# Altium schematic sheet Wall_Crawller_Application.SchDoc
size B; SheetNumber: 1; SheetTotal: 1
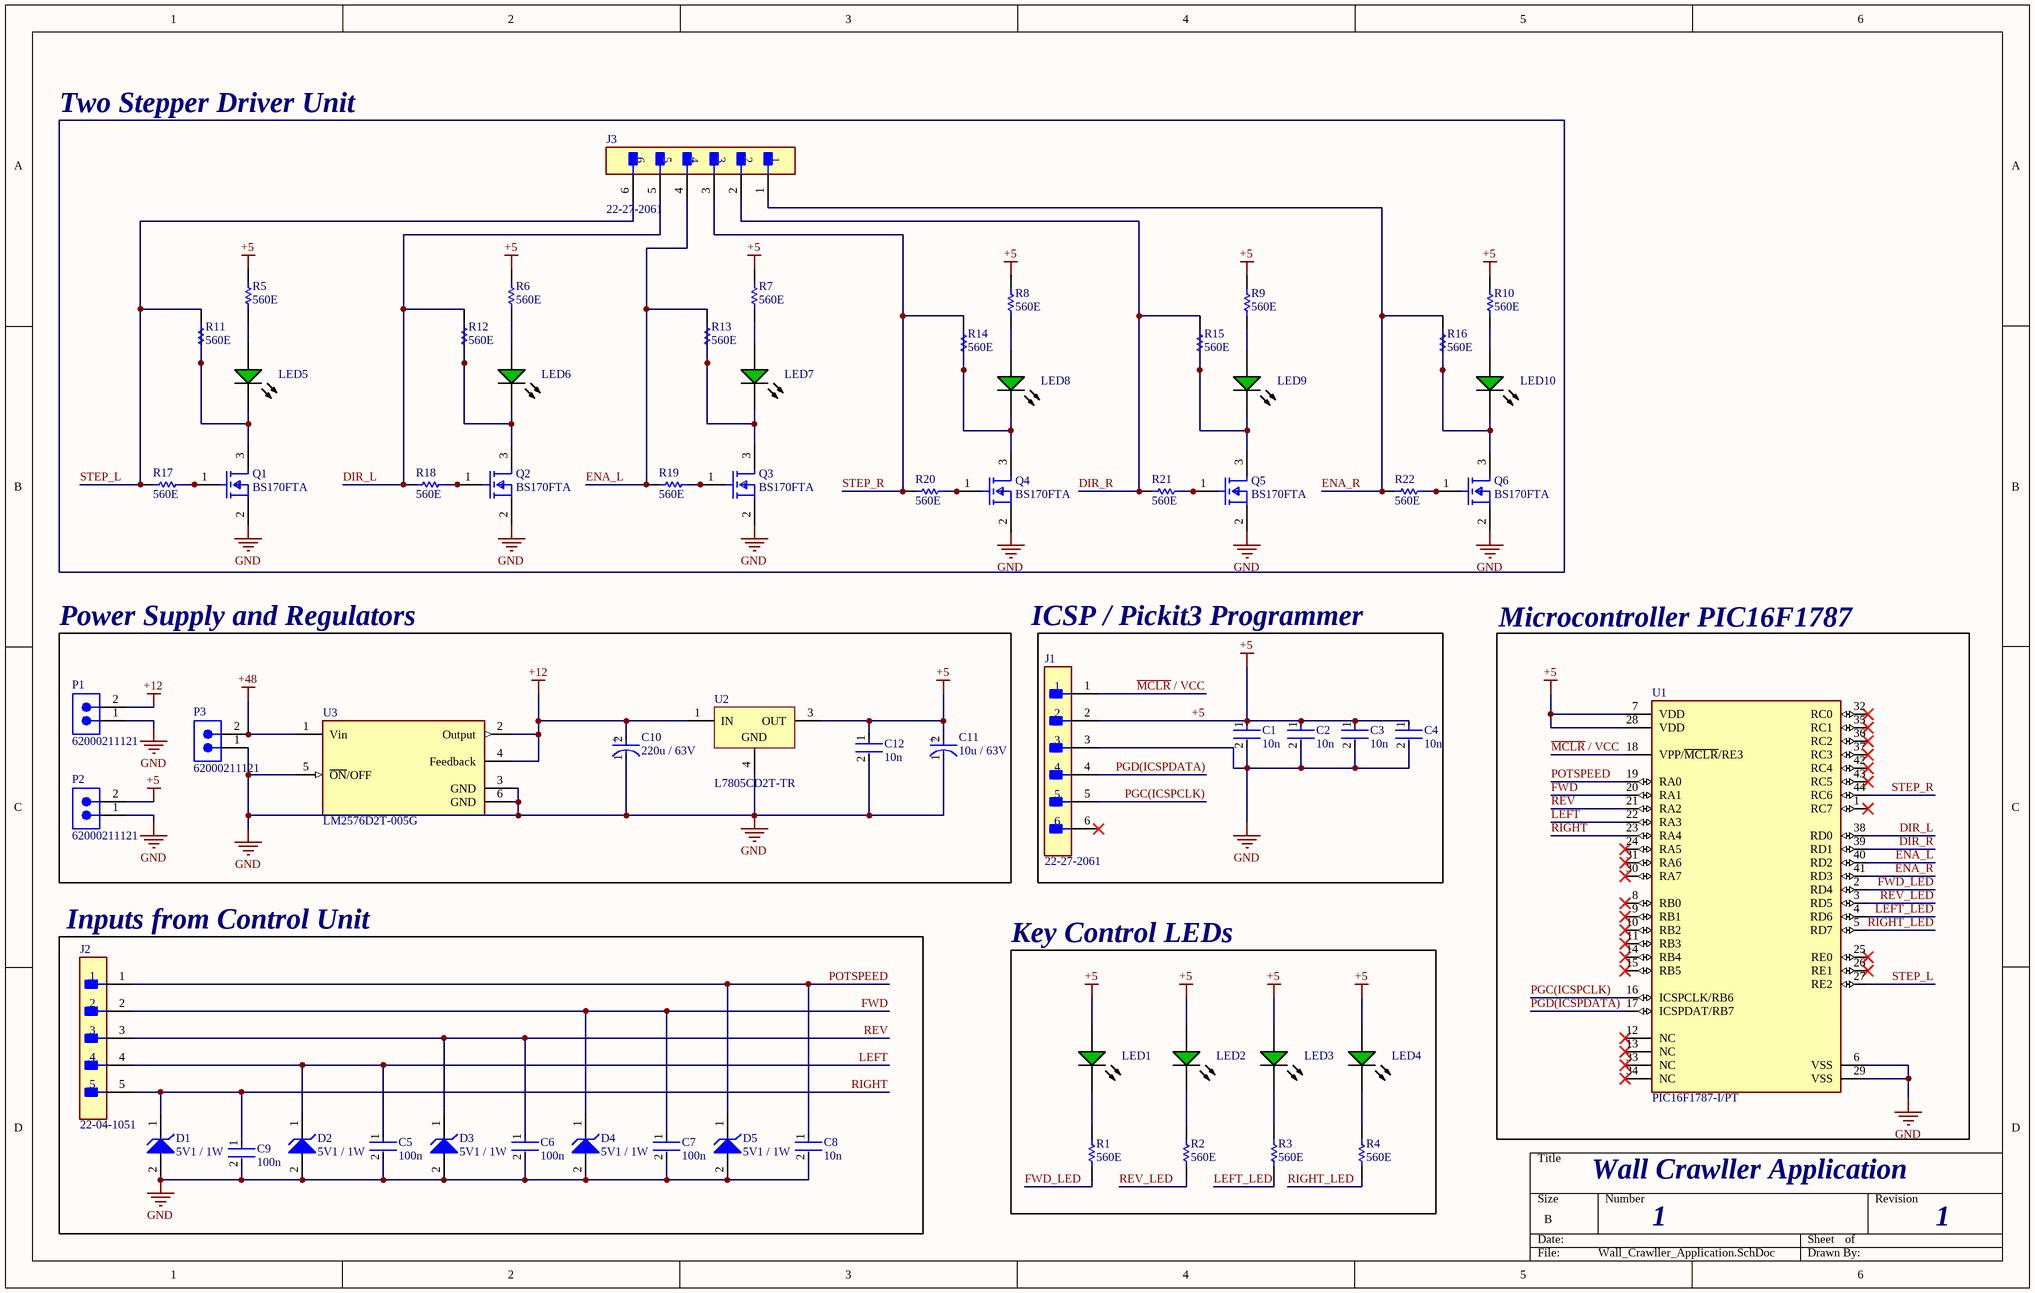
[diagram p0: Wall_Crawller_Application.SchDoc]

## Parts
C1  10n  [FP-C0805C-DN-MFG]
C2  10n  [FP-C0805C-DN-MFG]
C3  10n  [FP-C0805C-DN-MFG]
C4  10n  [FP-C0805C-DN-MFG]
C5  100n  [FP-C0805C-DN-MFG]
C6  100n  [FP-C0805C-DN-MFG]
C7  100n  [FP-C0805C-DN-MFG]
C8  10n  [FP-C0805C-DN-MFG]
C9  100n  [FP-C0805C-DN-MFG]
C10  220u / 63V  [FP-T491B107K006AT-MFG]
C11  10u / 63V  [FP-T491B107K006AT-MFG]
C12  10n  [FP-C0805C-DN-MFG]
D1  5V1 / 1W  [ONSC-SOD-123-2-425-04_V]
D2  5V1 / 1W  [ONSC-SOD-123-2-425-04_V]
D3  5V1 / 1W  [ONSC-SOD-123-2-425-04_V]
D4  5V1 / 1W  [ONSC-SOD-123-2-425-04_V]
D5  5V1 / 1W  [ONSC-SOD-123-2-425-04_V]
J1  22-27-2061  [FP-22-27-2061-MFG]
J2  22-04-1051  [FP-22-04-1051-MFG]
J3  22-27-2061  [FP-22-27-2061-MFG]
LED1  (no value)  [AVAG-HSMX-C170_V]
LED2  (no value)  [AVAG-HSMX-C170_V]
LED3  (no value)  [AVAG-HSMX-C170_V]
LED4  (no value)  [AVAG-HSMX-C170_V]
LED5  (no value)  [AVAG-HSMX-C170_V]
LED6  (no value)  [AVAG-HSMX-C170_V]
LED7  (no value)  [AVAG-HSMX-C170_V]
LED8  (no value)  [AVAG-HSMX-C170_V]
LED9  (no value)  [AVAG-HSMX-C170_V]
LED10  (no value)  [AVAG-HSMX-C170_V]
P1  62000211121  [62000211121]
P2  62000211121  [62000211121]
P3  62000211121  [62000211121]
Q1  BS170FTA  [FP-SOT23-IPC_A]
Q2  BS170FTA  [FP-SOT23-IPC_A]
Q3  BS170FTA  [FP-SOT23-IPC_A]
Q4  BS170FTA  [FP-SOT23-IPC_A]
Q5  BS170FTA  [FP-SOT23-IPC_A]
Q6  BS170FTA  [FP-SOT23-IPC_A]
R1  560E  [RESC2013X50X30LL20T20]
R2  560E  [RESC2013X50X30LL20T20]
R3  560E  [RESC2013X50X30LL20T20]
R4  560E  [RESC2013X50X30LL20T20]
R5  560E  [RESC2013X50X30LL20T20]
R6  560E  [RESC2013X50X30LL20T20]
R7  560E  [RESC2013X50X30LL20T20]
R8  560E  [RESC2013X50X30LL20T20]
R9  560E  [RESC2013X50X30LL20T20]
R10  560E  [RESC2013X50X30LL20T20]
R11  560E  [RESC2013X50X30LL20T20]
R12  560E  [RESC2013X50X30LL20T20]
R13  560E  [RESC2013X50X30LL20T20]
R14  560E  [RESC2013X50X30LL20T20]
R15  560E  [RESC2013X50X30LL20T20]
R16  560E  [RESC2013X50X30LL20T20]
R17  560E  [RESC2013X50X30LL20T20]
R18  560E  [RESC2013X50X30LL20T20]
R19  560E  [RESC2013X50X30LL20T20]
R20  560E  [RESC2013X50X30LL20T20]
R21  560E  [RESC2013X50X30LL20T20]
R22  560E  [RESC2013X50X30LL20T20]
U1  PIC16F1787-I/PT  [FP-C04-076-IPC_A]
U2  L7805CD2T-TR  [TO-263_M]
U3  LM2576D2T-005G  [FP-936A-02-MFG]

## Blocks framed on the sheet
Power Supply and Regulators: C10-C12 P1-P3 U2 U3
Microcontroller PIC16F1787: U1
Inputs from Control Unit: C5-C9 D1-D5 J2
Key Control LEDs: LED1-LED4 R1-R4

## Nets
+5: C1.1 C2.1 C3.1 C4.1 C11.2(A) C12.1 J1.2 LED1.1(A) LED2.1(A) LED3.1(A) LED4.1(A) P2.2 R5.2 R6.2 R7.2 R8.2 R9.2 R10.2 U1.7(VDD) U1.28(VDD) U2.3(OUT)
+12: C10.2(A) P1.2 U2.1(IN) U3.2(Output) U3.4(Feedback)
+48: P3.2 U3.1(Vin)
GND: C1.2 C2.2 C3.2 C4.2 C5.2 C6.2 C7.2 C8.2 C9.2 C10.1(C) C11.1(C) C12.2 D1.2(A) D2.2(A) D3.2(A) D4.2(A) D5.2(A) J1.3 P1.1 P2.1 P3.1 Q1.2(S) Q2.2(S) Q3.2(S) Q4.2(S) Q5.2(S) Q6.2(S) U1.6(VSS) U1.29(VSS) U2.4(GND) U3.3(GND) U3.5(~{ON}/OFF) U3.6(GND)
~{MCLR} / VCC: J1.1 U1.18(VPP/~{MCLR}/RE3)
DIR_L: J3.5 R12.2 R18.2 U1.38(RD0)
DIR_R: J3.2 R15.2 R21.2 U1.39(RD1)
ENA_L: J3.4 R13.2 R19.2 U1.40(RD2)
ENA_R: J3.1 R16.2 R22.2 U1.41(RD3)
FWD: C7.1 D4.1(K) J2.2 U1.20(RA1)
FWD_LED: R1.1 U1.2(RD4)
LEFT: C5.1 D2.1(K) J2.4 U1.22(RA3)
LEFT_LED: R3.1 U1.4(RD6)
PGC(ICSPCLK): J1.5 U1.16(ICSPCLK/RB6)
PGD(ICSPDATA): J1.4 U1.17(ICSPDAT/RB7)
POTSPEED: C8.1 D5.1(K) J2.1 U1.19(RA0)
REV: C6.1 D3.1(K) J2.3 U1.21(RA2)
REV_LED: R2.1 U1.3(RD5)
RIGHT: C9.1 D1.1(K) J2.5 U1.23(RA4)
RIGHT_LED: R4.1 U1.5(RD7)
STEP_L: J3.6 R11.2 R17.2 U1.27(RE2)
STEP_R: J3.3 R14.2 R20.2 U1.44(RC6)
NetLED1_2: LED1.2(K) R1.2
NetLED2_2: LED2.2(K) R2.2
NetLED3_2: LED3.2(K) R3.2
NetLED4_2: LED4.2(K) R4.2
NetLED5_1: LED5.1(A) R5.1
NetLED5_2: LED5.2(K) Q1.3(D) R11.1
NetLED6_1: LED6.1(A) R6.1
NetLED6_2: LED6.2(K) Q2.3(D) R12.1
NetLED7_1: LED7.1(A) R7.1
NetLED7_2: LED7.2(K) Q3.3(D) R13.1
NetLED8_1: LED8.1(A) R8.1
NetLED8_2: LED8.2(K) Q4.3(D) R14.1
NetLED9_1: LED9.1(A) R9.1
NetLED9_2: LED9.2(K) Q5.3(D) R15.1
NetLED10_1: LED10.1(A) R10.1
NetLED10_2: LED10.2(K) Q6.3(D) R16.1
NetQ1_1: Q1.1(G) R17.1
NetQ2_1: Q2.1(G) R18.1
NetQ3_1: Q3.1(G) R19.1
NetQ4_1: Q4.1(G) R20.1
NetQ5_1: Q5.1(G) R21.1
NetQ6_1: Q6.1(G) R22.1

Not connected (* = marked no-connect by the designer): J1 6*; U1 1(RC7)* 8(RB0)* 9(RB1)* 10(RB2)* 11(RB3)* 12(NC)* 13(NC)* 14(RB4)* 15(RB5)* 24(RA5)* 25(RE0)* 26(RE1)* 30(RA7)* 31(RA6)* 32(RC0)* 33(NC)* 34(NC)* 35(RC1)* 36(RC2)* 37(RC3)* 42(RC4)* 43(RC5)*

## Notes on the sheet
- Two Stepper Driver Unit
- ICSP / Pickit3 Programmer
- Wall Crawller Application
- 1
- (in symbol CMP-03017-000031-1) +

## Library data of the parts
C1-C9 C12 = CMP-1036-04552-2: CAP CER 10nF 50V X7R 0805; Manufacturer: KEMET; Manufacturer Part Number: C0805C224K5RACTU; Value: 0.22 μF; Temperature Coefficient: 30ppm/°C; Material: Ceramic; Tolerance: 0.1; ComponentLink2URL: https://content.kemet.com/datasheets/KEM_C1003_C0G_SMD.pdf; Temperature Characteristic: X7R; Device Class L3: Ceramic Capacitors; Lead Free: Yes; Temperature: -55°C to +125°C; RoHS: TRUE; Capacitance: 0.22 μF; Automotive: No; Octopart: https://octopart.com/c0805c224k5ractu-kemet-144670; Temperature Range Low: -55°C; Height: 0.88mm; Device Class L1: Passive Components; Digikey Description: CAP CER 0.22UF 50V X7R 0805; ComponentLink2Description: Datasheet; Mouser Description: CAP CER 0.22UF 50V X7R 0805; Category: Cap; Ipc Land Pattern Name: CAPC200125X78; Temperature Range High: +125°C; Package: C0805C-DN; Device Class L2: Capacitors; Voltage Rating: 50 V
C10 C11 = CMP-03017-000031-1: CAP TANT 10UF 10% 63V 1411; Voltage Rating (DC): 6V; Voltage: 6.3V; ESR (Equivalent Series Resistance): 3R; Dielectric Material: Tantalum; Leakage Current: 6.3uA; Dissipation Factor: 15%; Polarity: Polar; Capacitance: 100uF; Life (Hours): 2000Hour; Case Code (Imperial): 1411; Radiation Hardening: No; Failure Rate: 0.001%; Max Operating Temperature: 125°C; Min Operating Temperature: -55°C; Voltage Rating: 6.3V; Length: 3.5mm; Depth: 2.8mm; Package Quantity: 1; Case/Package: 1411; Height - Seated (Max): 0.083inch; Termination: SMD/SMT; REACH SVHC: No SVHC; Width: 2.8mm; Mount: Surface Mount; Number of Pins: 2; Case Code (Metric): 3528; Tolerance: 10%; Lead Free: Lead Free; Features: General Purpose; Height: 1.9mm; Packaging: Tape and Reel; RoHS Compliant: Yes
D1-D5 = CMP-1060-00606-1: Zener Voltage Regulator, 500 mW, 2-Pin SOD-123, Pb-Free, Tape and Reel; Manufacturer: On Semiconductor; PartNumber: MMSZ4691T1G; VZ Typ (V): 6.2; P Max (W): 0.5; DatasheetVersion: Rev. 9; ComponentLink1Description: Manufacturer URL; PackageReference: SOD-123-2-425-04; RoHS: Pb-Free; Mounting Technology: Surface Mount; ComponentLink3URL: http://www.onsemi.com/pub_link/Collateral/425-04.PDF; Packing: Tape and Reel; ComponentLink2URL: http://www.onsemi.com/pub_link/Collateral/MMSZ4678T1-D.PDF; PackageVersion: Rev. G, 10/2009; ComponentLink1URL: http://www.onsemi.com/; PackageDescription: 2-Pin SOD, Body 1.6 x 2.69 mm; ComponentLink2Description: Datasheet; ComponentLink3Description: Package Specification
J1 J3 = CMP-04776-000309-1: CONN HEADER VERT 6POS 2.54MM; Number of Contacts: 6; Current Rating: 4A; Voltage Rating (AC): 250V; Contact Resistance: 10mR; Hole Diameter: 1.02mm; Connector Type: Male Pin; Gender: Male; Mount: Through Hole; REACH SVHC: No SVHC; Number of Rows: 1; Contact Plating: Tin; Series: KK; Depth: 5.8mm; Flammability Rating: UL94 V-0; Contact Type: Male Pin; Lead Pitch: 2.54mm; Min Operating Temperature: 0°C; Pitch: 2.54mm; Radiation Hardening: No; Color: Natural; Length: 15.24mm; Termination: Solder; Orientation: Straight; Contact Material: Brass; Max Voltage Rating (AC): 250V; Housing Material: Nylon; Max Operating Temperature: 75°C; Working Voltage: 250V; Max Current Rating: 4A; Fastening Type: Friction; Voltage Rating: 250V; Housing Color: White; Packaging: Bulk; Material: Nylon; Contact Mating Length: 0.295inch; Package Quantity: 10000; Number of Positions: 6
J2 = CMP-00257-00247488-1: 22-04-1051 KK Mini-Latch Straight Male, PCB Header, Through Hole, 1 Rows, 5 Contacts, 2.5mm Pitch; Manufacturer Lifecycle Status: ACTIVE; NexarPartId: 247488; Insulation Resistance: 1GΩ; Current Rating: 3A; Glow Wire Compliant: Non-compliant; Plating: Tin; Number of Circuits: 5; Voltage Rating: 250V; Contact Resistance: 20mΩ; Connector Type: Male Pin; Max Voltage Rating (DC): 250.25kV; Termination: Solder; Number of Rows: 1; REACH SVHC: Unknown; Number of Pins: 5; Length: 12mm; Pitch: 2.5mm; Schedule B: 8536694040; Min Operating Temperature: -40°C; RoHS: Compliant; Radiation Hardening: No; Contact Mating Length: 7.493mm; Packaging: Bulk; Halogen Free: Low Halogen; Housing Color: Natural; Max Operating Temperature: 105°C; Housing Material: Nylon; Lead Pitch: 2.5mm; Max Voltage Rating (AC): 250V; Number of Positions: 5; Gender: Male; Material: Nylon; Contact Plating: Tin; Depth: 4.9mm; Flammability Rating: UL94 V-0; Lead Free: Lead Free; Fastening Type: Friction; Color: Natural; Orientation: Vertical; Lifecycle Status: Production; Number of Contacts: 5; Voltage Rating (DC): 250V; Voltage Rating (AC): 250V; Country of Origin: TW; Contact Material: Brass; Mount: Through Hole
LED1-LED10 = CMP-2000-05062-1: Chip LED, Green, 2.2 V, -40 to 85 degC, 2-Pin SMD, Pb-Free, Tape and Reel; Manufacturer: Avago; No. of Pins: 2; Peak Wavelength: 570nm; SVHC: NoSVHC(16-Jun-2014); Dominant Wavelength: 572nm; Forward Current If: 20mA; Viewing Angle: 170deg; Lens Shape: Rectangular; PIV Max: 5V; External Width: 1.25mm; LED Type: Standard; External Depth: 0.8mm; Opto Mounting Orientation: Top; Luminous Intensity: 15mcd; Luminous Intensity Min: 4mcd; Forward Voltage VF Max: 2.6V; External Length / Height: 2mm; Bulb Size: 1.25mmx1.4mm; Light Area Height: 1mm; Voltage Vf Typ: 2.2V; Operating Temperature Max: 85degC; Datasheet Version: Oct-08; MSL: MSL2A-4weeks; Peak Forward Current: 20mA; Package Description: 2-Pin Surface Mount Device, Body 2 x 1.25 mm, Height 0.8 mm; Datasheet URL: https://datasheet.ciiva.com/29280/180495-da-01-en-chip-led-hsmg-c170-gelb-gruen-29280971.pdf; Storage Temperature Min: -40degC; LED Colour: Green; Wavelength Typ: 570nm; Mounting Type: SMD; Forward Current If Max: 20mA; Dominant Wavelength Typ: 572nm; LED Mounting: SMD; Operating Temperature Range: -30degCto+85degC; Operating Temperature Min: -30degC; Manufacturer URL: http://www.avagotech.com/; Packaging: CutTape; Luminous Intensity Typ: 15mcd; Package Reference: HSMX-C170; Storage Temperature Max: 85degC; Opto Case Style: SMD; Forward Voltage: 2.2V
P1-P3 = CMP-1502-00956-3: NexarPartId: 61924778; Number of Contacts: 2; Voltage Rating: 200V; Gender: Male; Contact Resistance: 20mΩ; Current Rating: 2A; Lead Pitch: 2mm; Max Operating Temperature: 105°C; Contact Material: Gold; Number of Rows: 1; Operating Supply Voltage: 200V; Number of Pins: 2; Orientation: Vertical; Min Operating Temperature: -40°C; Height: 6.35mm; RoHS: Non-Compliant
Q1-Q6 = CMP-12801-000064-2: MOSFET N-CH 60V .15MA SOT23-3; On-State Resistance: 5R; Continuous Drain Current (ID): 150mA; Threshold Voltage: 3V; Number of Channels: 1; Gate to Source Voltage (Vgs): 20V; Turn-On Delay Time: 10ns; Power Dissipation: 330mW; Element Configuration: Single; Input Capacitance: 60pF; Weight: 0.000282oz; Height: 1mm; Max Operating Temperature: 150°C; Dual Supply Voltage: 60V; Termination: SMD/SMT; Number of Pins: 3; Number of Elements: 1; Mount: Surface Mount; Min Operating Temperature: -55°C; Nominal Vgs: 3V; Width: 1.4mm; Drain to Source Breakdown Voltage: 60V; Turn-Off Delay Time: 10ns; Case/Package: SOT-23; REACH SVHC: No SVHC; Packaging: Tape and Reel; Length: 3.05mm; Max Power Dissipation: 330mW; Rds On Max: 5R; Lead Free: Lead Free; Contact Plating: Tin; Drain to Source Resistance: 5R; Drain to Source Voltage (Vdss): 60V; Package Quantity: 3000; Current Rating: 150mA; Voltage Rating (DC): 60V
R1-R22 = CMP-2001-04896-1: Manufacturer: Vishay Dale; Part Number: CRCW08050000Z0EA
U1 = CMP-06276-000510-1: IC MCU 8BIT 14KB FLASH 44TQFP; Number of USB Channels: 1; Address Bus Width: 8b; Supply Current: 2.1mA; Number of PWM Channels: 3; Number of Programmable I/O: 36; RAM Size: 1KB; Core Architecture: PIC; Min Supply Voltage: 2.3V; Interface: I2C; Max Supply Voltage: 5.5V; Peripherals: PWM; Frequency: 32MHz; Number of ADC Channels: 14; RoHS Compliant: Yes; Min Operating Temperature: -40°C; Length: 10mm; Number of I2C Channels: 1; Data Bus Width: 8b; Number of Pins: 44; Mount: Surface Mount; Max Operating Temperature: 85°C; Packaging: Tray; Series: PIC16; Width: 10mm; Lead Free: Lead Free; Number of Timers/Counters: 3; Number of I/Os: 36; Number of SPI Channels: 1; Reach SVHC Compliant: Yes; Nominal Supply Current: 2.1mA; Max Frequency: 32MHz; Height: 1.05mm; Memory Type: FLASH; Package Quantity: 160; Case/Package: TQFP; Memory Size: 14KB
U2 = CMP-0244-00213-1: Positive Voltage Regulator, 3-Pin D2PAK, Tape and Reel; PackageReference: TO-263; ComponentLink2URL: http://www.st.com/internet/com/TECHNICAL_RESOURCES/TECHNICAL_LITERATURE/DATASHEET/CD00000444.pdf; PackageDescription: 3-Pin Transistor Outline Package 2.54 mm Pitch, 15.4 mm Lead Span (D2PAK); DatasheetVersion: 16/11/2011; ComponentLink2Description: Datasheet; ComponentLink1Description: Manufacturer URL; PackageVersion: 2011; ComponentLink1URL: http://www.st.com
U3 = CMP-07129-000010-1: IC REG MULTI CONFG 5V 3A D2PAK-5; Manufacturer: ON Semiconductor; Standoff Height: 0mm; Max Junction Temp: +125°C; Output Type: Fixed; Switching Frequency: 52kHz; Switching Topology: Buck; Number Of Outputs: 1; Nominal Supply Current: 5mA; Max Supply Voltage: 40V; Max Duty Cycle: 98%; Min Supply Voltage: 7V; Category: IC; Device Class L2: Power Management ICs; Footprint Url: https://www.onsemi.com/pub/Collateral/936A-02.PDF; Temperature: -40°C to +125°C; Device Class L3: Voltage Regulators - Switching; Height: 4.826mm; Lead Free: Yes; Manufacturer Part Number: LM2576D2T-005G; Automotive: No; Temperature Range Low: -40°C; RoHS: TRUE; Digikey Description: IC REG MULTI CONFG 5V 3A D2PAK-5; Package: 936A-02; Octopart: https://octopart.com/lm2576d2t-005g-on+semiconductor-725168; Device Class L1: Integrated Circuits (ICs); Temperature Range High: +125°C; Mouser Description: Buck Regulator, Switching, 3.0 A, 15 V 3.0 A, 5.0 V, 52 kHz; Output Voltage: 5V; ComponentLink2URL: https://www.onsemi.cn/PowerSolutions/document/LM2576-D.PDF; ComponentLink2Description: Datasheet; Output Current: 3A